# EAGLE design fio_v1.1 (EAGLE 5.02)
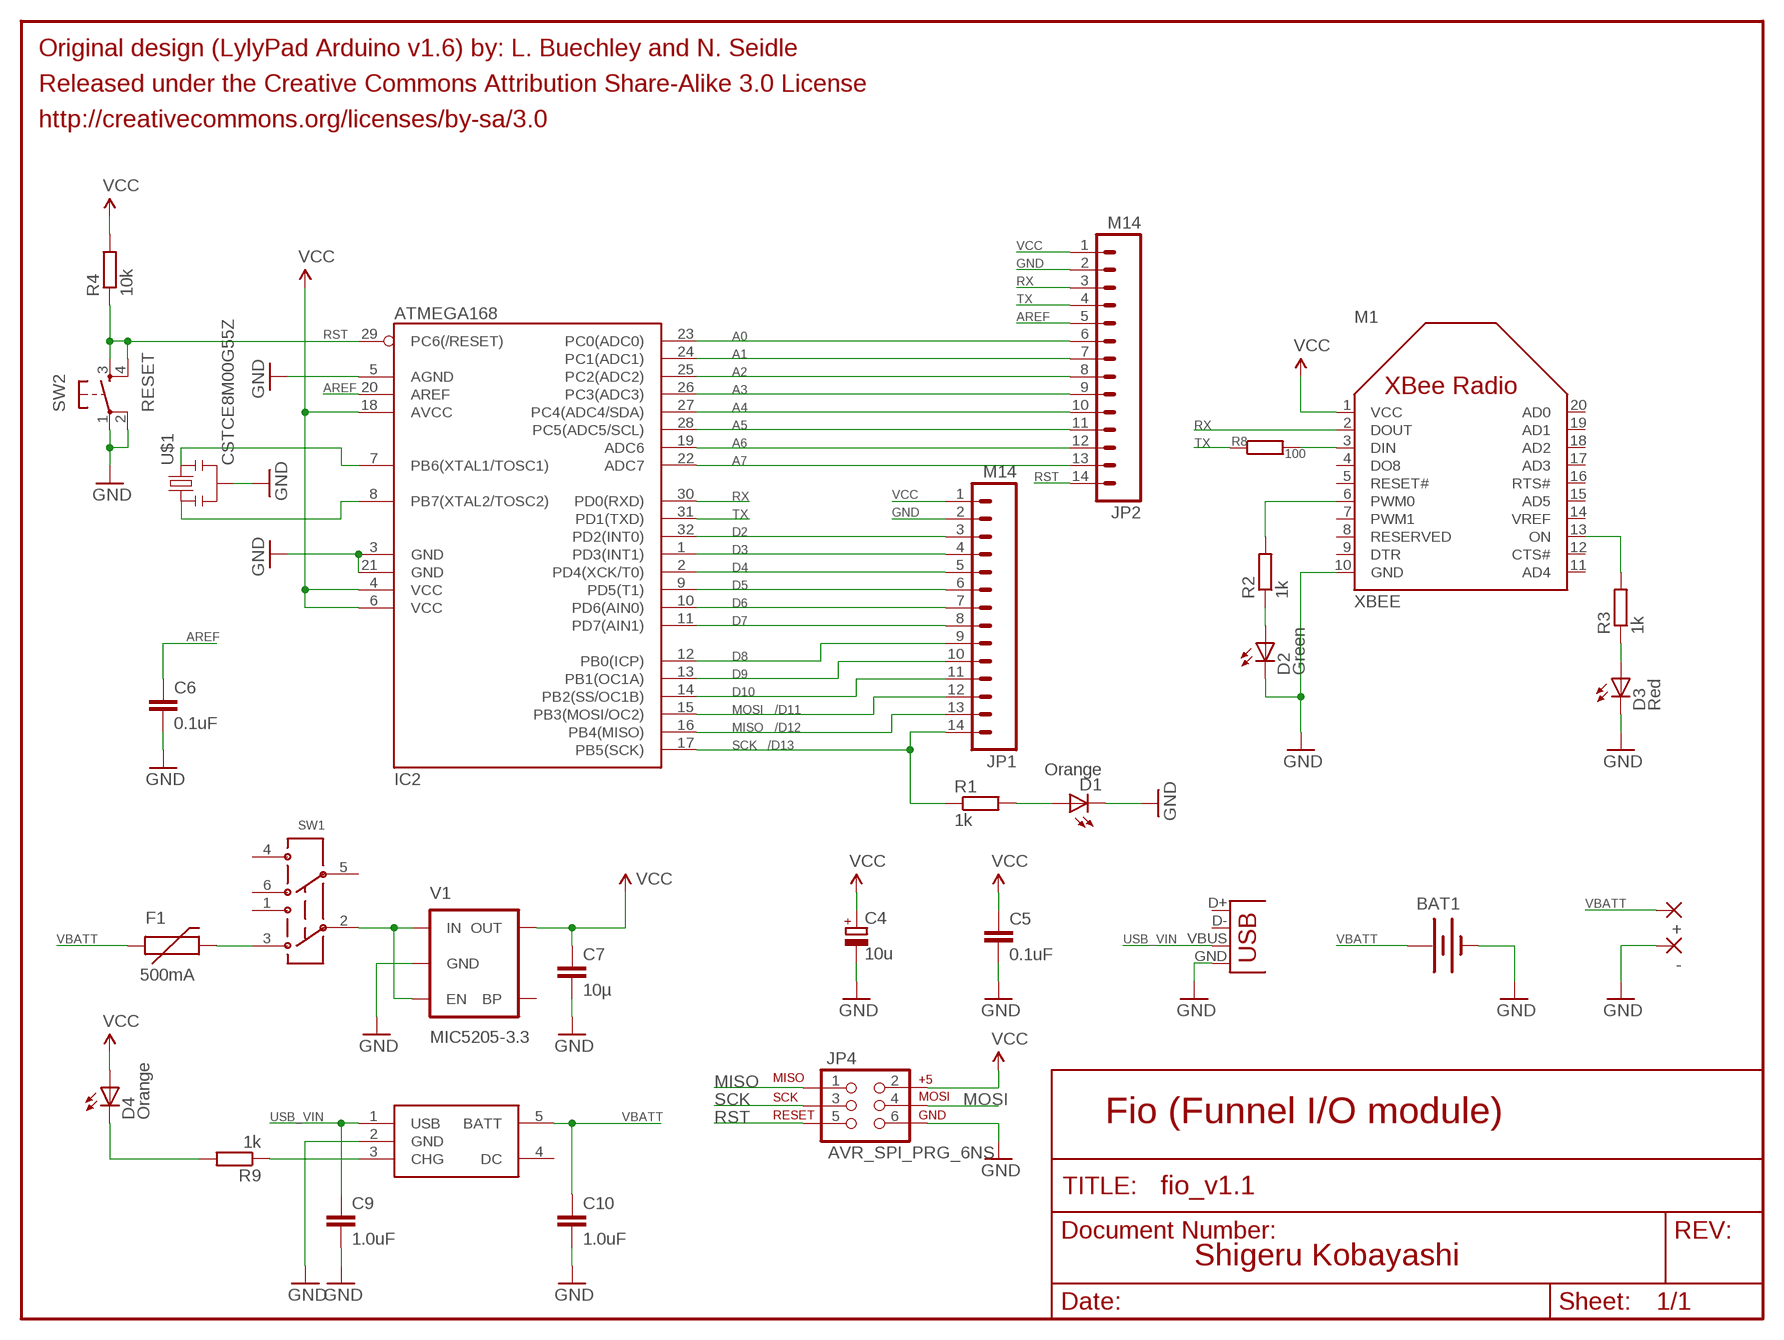
[diagram p0: schematic, sheet 1]

## Parts
+  SMD5  [SMD2,54-5,08]
-  SMD5  [SMD2,54-5,08]
BAT1  BATTERY2032  [BA2032SM]
C4  10u  CPOL-EUC  [PANASONIC_C]
C5  0.1uF  CAP0603  [0603]
C6  0.1uF  CAP0603  [0603]
C7  10µ  C-EUC0805K  [C0805K]
C9  1.0uF  CAP0603  [0603]
C10  1.0uF  CAP0603  [0603]
D1  Orange  LEDCHIPLED_0805  [CHIPLED_0805]
D2  Green  LEDCHIPLED_0805  [CHIPLED_0805]
D3  Red  LEDCHIPLED_0805  [CHIPLED_0805]
D4  Orange  LEDCHIPLED_0805  [CHIPLED_0805]
F1  500mA  PTCSMD  [PTC-1206]
IC2  ATMEGA168  [TQFP32-08]
JP1  M14  [1X14]
JP2  M14  [1X14]
JP4  AVR_SPI_PRG_6NS  [2X3-NS]
M1  XBEE  [XBEE]
R1  1k  R-EU_R0603  [R0603]
R2  1k  R-EU_R0603  [R0603]
R3  1k  R-EU_R0603  [R0603]
R4  10k  R-EU_R0603  [R0603]
R8  100  R-EU_R0603  [R0603]
R9  1k  R-EU_R0603  [R0603]
SW1  AYZ0202  [AYZ0202]
SW2  RESET  OMRON_B3SN-3012  [B3SN-3012]
U1  MAX1555  [SOT23-5]
U$1  CSTCE8M00G55Z  RESONATORSMD  [RESONATOR-SMD]
V1  MIC5205-3.3  V_REG_LDOSMD  [SOT23-5]
X1  USBSMD  [USB-MINIB]

## Nets
A0: IC2.23(PC0(ADC0)) JP2.6
A1: IC2.24(PC1(ADC1)) JP2.7
A2: IC2.25(PC2(ADC2)) JP2.8
A3: IC2.26(PC3(ADC3)) JP2.9
A4: IC2.27(PC4(ADC4/SDA)) JP2.10
A5: IC2.28(PC5(ADC5/SCL)) JP2.11
A6: IC2.19(ADC6) JP2.12
A7: IC2.22(ADC7) JP2.13
AREF: C6.1 IC2.20(AREF) JP2.5
D2: IC2.32(PD2(INT0)) JP1.3
D3: IC2.1(PD3(INT1)) JP1.4
D4: IC2.2(PD4(XCK/T0)) JP1.5
D5: IC2.9(PD5(T1)) JP1.6
D6: IC2.10(PD6(AIN0)) JP1.7
D7: IC2.11(PD7(AIN1)) JP1.8
D8: IC2.12(PB0(ICP)) JP1.9
D9: IC2.13(PB1(OC1A)) JP1.10
D10: IC2.14(PB2(SS/OC1B)) JP1.11
GND: -.1(P) BAT1.- C4.- C5.2 C6.2 C7.2 C9.2 C10.2 D1.C D2.C D3.C IC2.3(GND) IC2.5(AGND) IC2.21(GND) JP1.2 JP2.2 JP4.6 M1.10(GND) SW2.1 SW2.2 U1.2(GND) U$1.2 V1.2(GND) X1.GND
MISO: IC2.16(PB4(MISO)) JP1.13 JP4.1
MOSI: IC2.15(PB3(MOSI/OC2)) JP1.12 JP4.4
N$1: M1.13(ON) R3.2
N$2: D1.A R1.2
N$3: D2.A R2.1
N$4: M1.6(PWM0) R2.2
N$5: SW1.2 V1.1(IN) V1.3(EN)
N$6: D3.A R3.1
N$7: M1.3(DIN) R8.2
N$8: D4.C R9.2
N$9: F1.2 SW1.3
N$10: IC2.7(PB6(XTAL1/TOSC1)) U$1.3
N$11: R9.1 U1.3(CHG)
N$12: IC2.8(PB7(XTAL2/TOSC2)) U$1.1
RST: IC2.29(PC6(/RESET)) JP2.14 JP4.5 R4.1 SW2.3 SW2.4
RX: IC2.30(PD0(RXD)) JP2.3 M1.2(DOUT)
SCK: IC2.17(PB5(SCK)) JP1.14 JP4.3 R1.1
TX: IC2.31(PD1(TXD)) JP2.4 R8.1
USB_VIN: C9.1 U1.1(USB) X1.VBUS
VBATT: +.1(P) BAT1.+ C10.1 F1.1 U1.5(BATT)
VCC [VCC]: C4.+ C5.1 C7.1 D4.A IC2.4(VCC) IC2.6(VCC) IC2.18(AVCC) JP1.1 JP2.1 JP4.2 M1.1(VCC) R4.2 V1.5(OUT)
Unconnected: M1.4(DO8) M1.5(RESET#) M1.7(PWM1) M1.8(RESERVED) M1.9(DTR) M1.11(AD4) M1.12(CTS#) M1.14(VREF) M1.15(AD5) M1.16(RTS#) M1.17(AD3) M1.18(AD2) M1.19(AD1) M1.20(AD0) SW1.1 SW1.4 SW1.5 SW1.6 U1.4(DC) V1.4(BP) X1.D+ X1.D-

## Notes on the sheet
- Original design (LylyPad Arduino v1.6) by: L. Buechley and N. Seidle
- Released under the Creative Commons Attribution Share-Alike 3.0 License
- http://creativecommons.org/licenses/by-sa/3.0
- /D11
- /D12
- /D13
- Fio (Funnel I/O module)
- Shigeru Kobayashi

## Library data of the parts
+ - = wirepad:SMD5: SMD PAD
BAT1 = memory_protection_devices:BATTERY: Battery Holders 2032 coin cell and 2450 coin cell.
C4 = rcl:CPOL-EU: POLARIZED CAPACITOR, European symbol
C5 C6 C9 C10 = SparkFun:CAP: Capacitor Standard 0603 ceramic capacitor, and 0.1" leaded capacitor.
C7 = rcl:C-EU: CAPACITOR, European symbol
D1-D4 = led:LED: LED OSRAM: - CHIPLED LG R971, LG N971, LY N971, LG Q971, LY Q971, LO R971, LY R971 LH N974, LH R974 LS Q976, LO Q976, LY Q976 LO Q996 - Hyper CHIPLED LW Q18S LB Q993, LB Q99A, LB R99A - SideLED LS A670, LO A670, LY A670, LG A670, LP A670 LB A673, LV A673, LT A673, LW A673 LH A674 LY A675 LS A676, LA A676, LO A676, LY A676, LW A676 LS A679, LY A679, LG A679 - Hyper Micro SIDELED® LS Y876, LA Y876, LO Y876, LY Y876 LT Y87S - SmartLED LW L88C, LW L88S LB L89C, LB L89S, LG L890 LS L89K, LO L89K, LY L89K LS L896, LA L896, LO L896, LY L896 - TOPLED LS T670, LO T670, LY T670, LG T670, LP T670 LSG T670, LSP T670, LSY T670, LOP T670, LYG T670 LG T671, LOG T671, LSG T671 LB T673, LV T673, LT T673, LW T673 LH T674 LS T676, LA T676, LO T676, LY T676, LB T676, LH T676, LSB T676, LW T676 LB T67C, LV T67C, LT T67C, LS T67K, LO T67K, LY T67K, LW E67C LS E67B, LA E67B, LO E67B, LY E67B, LB E67C, LV E67C, LT E67C LW T67C LS T679, LY T679, LG T679 LS T770, LO T770, LY T770, LG T770, LP T770 LB T773, LV T773, LT T773, LW T773 LH T774 LS E675, LA E675, LY E675, LS T675 LS T776, LA T776, LO T776, LY T776, LB T776 LHGB T686 LT T68C, LB T68C - Hyper Mini TOPLED® LB M676 - Mini TOPLED Santana® LG M470 LS M47K, LO M47K, LY M47K Source: http://www.osram.convergy.de - LUMILED® LXK2-PW12-R00, LXK2-PW12-S00, LXK2-PW14-U00, LXK2-PW14-V00 LXK2-PM12-R00, LXK2-PM12-S00, LXK2-PM14-U00 LXK2-PE12-Q00, LXK2-PE12-R00, LXK2-PE12-S00, LXK2-PE14-T00, LXK2-PE14-U00 LXK2-PB12-K00, LXK2-PB12-L00, LXK2-PB12-M00, LXK2-PB14-N00, LXK2-PB14-P00, LXK2-PB14-Q00 LXK2-PR12-L00, LXK2-PR12-M00, LXK2-PR14-Q00, LXK2-PR14-R00 LXK2-PD12-Q00, LXK2-PD12-R00, LXK2-PD12-S00 LXK2-PH12-R00, LXK2-PH12-S00 LXK2-PL12-P00, LXK2-PL12-Q00, LXK2-PL12-R00 Source: www.luxeon.com
F1 = SparkFun:PTC: Resettable Fuse PTC Resettable Fuse. Spark Fun Electronics SKU : COM-08357
IC2 = SparkFun:ATMEGA168
JP1 JP2 = SparkFun:M14: Header 14 Standard 14-pin 0.1" header. Use with straight break away headers (SKU : PRT-00116), right angle break away headers (PRT-00553), swiss pins (PRT-00743), machine pins (PRT-00117), and female headers (PRT-00115).
JP4 = SparkFun:AVR_SPI_PRG_6: AVR ISP 6 Pin This is the reduced ISP connector for AVR programming. Common on Arduino. This footprint will take up less PCB space and can be used with a 10-pin to 6-pin adapter such as SKU: BOB-08508
M1 = digi_xbee:XBEE
R1-R4 R8 R9 = rcl:R-EU_: RESISTOR, European symbol
SW1 = SparkFun:AYZ0202: SPDT Slide Switch Simple SMD single-pull double-throw slide switch. Good for less than 350mA power switch, switching UARTs between devices, etc. Spark Fun Electronics SKU : COM-00597
SW2 = omron_b3sn:OMRON_: Momentary Switch Button commonly used for reset or general input. Spark Fun Electronics SKU : COM-00097
U1 = SparkFun:MAX1555: MAX1555 Lithium Charger IC SOT-23 Lithium Polymer charging IC. Schematic element and footprint proven. Spark Fun Electronics SKU : COM-00674
U$1 = SparkFun:RESONATOR: Resonator Small SMD resonator. This is the itty bitty 10/20MHz resonators with built in caps. CSTCE10M0G55 and CSTCE20M0V53. Footprint has been reviewed closely but hasn't been tested yet.
V1 = SparkFun:V_REG_LDO: Voltage Regulator LDO Standard 150mA LDO voltage regulator in SOT-23 layout. Micrel part MIC5205. BP (by-pass) pin is used to lower output noise with 470pF cap.
X1 = SparkFun:USB: USB Connectors USB-B-PTH is fully proven SKU : PRT-00139 USB-miniB is fully proven SKU : PRT-00587 USB-A-PCB is untested. USB-A-H is throughly reviewed, but untested. Spark Fun Electronics SKU : PRT-00437 USB-B-SMT is throughly reviewed, but untested. Needs silkscreen touching up. USB-A-S has not been used/tested USB-MB-H has not been used/tested

## Net classes
0 Default: width 0.203 mm
1 VCC: width 0.381 mm
2 LEDPower: width 0.203 mm
3 ButtonSignal: width 0.203 mm

## Board
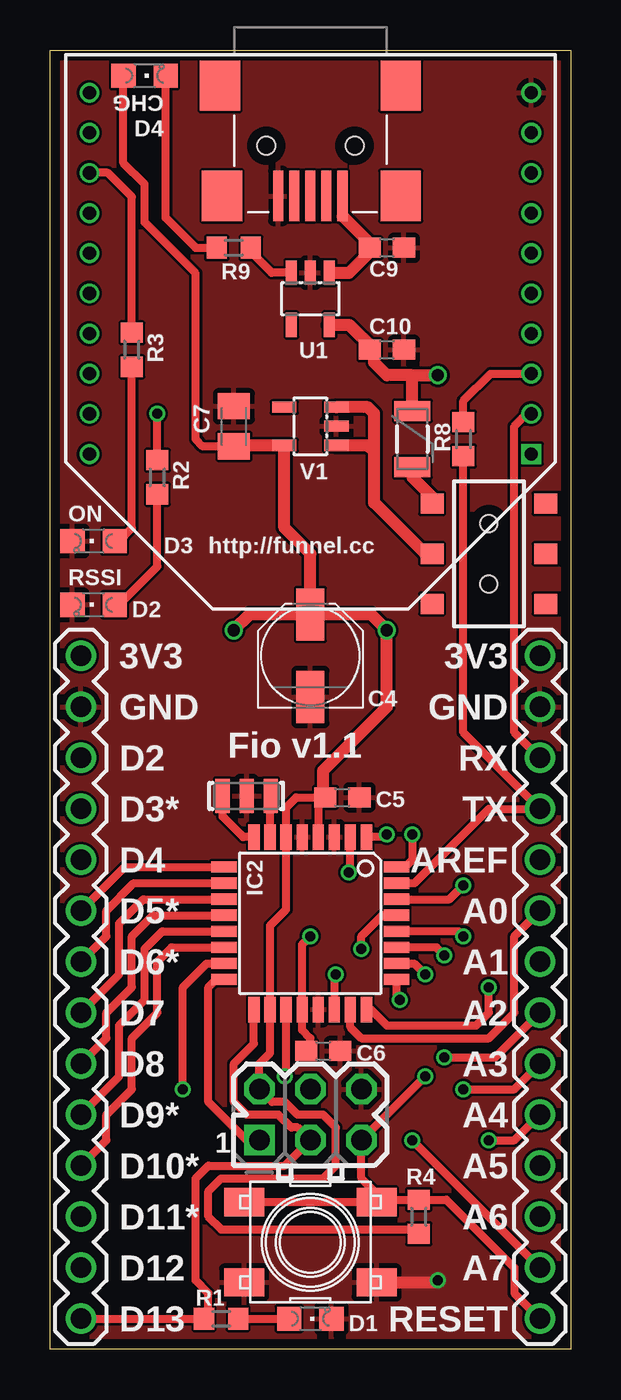
[diagram p1: board, top side]
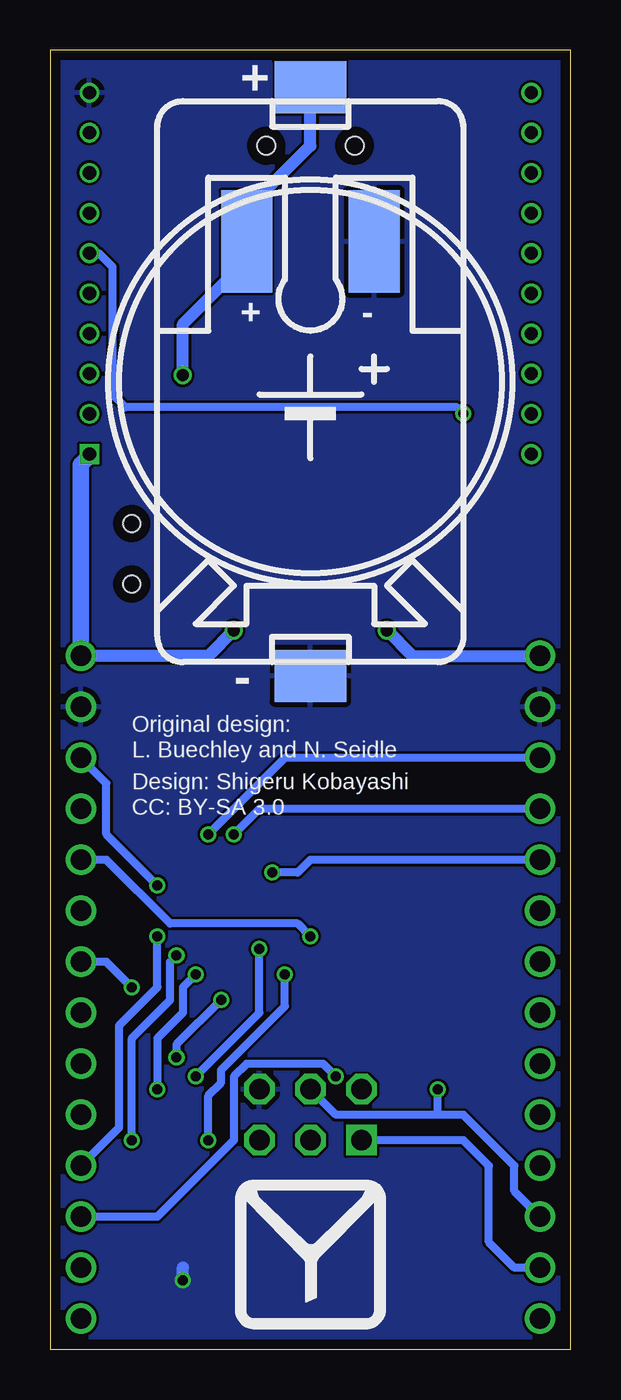
[diagram p2: board, bottom side, seen from below]

Size 25.91 x 64.71 mm. Coordinates in mm from the lower left corner, seen from the top.
Outline: 25.91,64.71 25.91,0 0,0 0,64.71 25.91,64.71
Copper layers (1*16): Top 0.035mm / dielectric 1.5mm / Bottom 0.035mm
Design rules "p_ban_2layer *": minimum track width 5mil, minimum drill 0.3mm, track to track 5mil, track to pad 5mil, pad to pad 5mil, via to via 5mil, smd to smd 5mil, copper to edge 0.5mm, drill to drill 0.3mm, minimum pad ring 0.15mm, minimum via ring 0.15mm, stop-mask expansion 4mil, vias tented up to drill 0.35mm, thermal gap 10mil

### Footprints (pad centres in the part's own frame; a part is rotated, then mirrored left to right if it is on the bottom)
SMD2,54-5,08 = smd 2.54 x 5.08: 1 0,0
BA2032SM = smd 2.591 x 3.556: + 14.656,0; - -14.656,0
PANASONIC_C = smd 2.6 x 1.4: + 2.05,0; - -2.05,0
0603@1 = smd 1.1 x 1: 1 -0.85,0; 2 0.85,0
C0805K = smd 1.3 x 1.6: 1 -1,0; 2 1,0
CHIPLED_0805 = smd 1.2 x 1.2: A 0,-1.05; C 0,1.05
PTC-1206 = smd 1 x 1.8: 1 -1.4,0; 2 1.4,0
TQFP32-08 = smd 1.27 x 0.559: 1 -4.293,2.8; 2 -4.293,2; 3 -4.293,1.2; 4 -4.293,0.4; 5 -4.293,-0.4; 6 -4.293,-1.2; 7 -4.293,-2; 8 -4.293,-2.8; 17 4.293,-2.8; 18 4.293,-2; 19 4.293,-1.2; 20 4.293,-0.4; 21 4.293,0.4; 22 4.293,1.2; 23 4.293,2; 24 4.293,2.8 | smd 0.559 x 1.27: 9 -2.8,-4.293; 10 -2,-4.293; 11 -1.2,-4.293; 12 -0.4,-4.293; 13 0.4,-4.293; 14 1.2,-4.293; 15 2,-4.293; 16 2.8,-4.293; 25 2.8,4.293; 26 2,4.293; 27 1.2,4.293; 28 0.4,4.293; 29 -0.4,4.293; 30 -1.2,4.293; 31 -2,4.293; 32 -2.8,4.293
1X14 = drill 1.016 round: 1 0,0; 2 2.54,0; 3 5.08,0; 4 7.62,0; 5 10.16,0; 6 12.7,0; 7 15.24,0; 8 17.78,0; 9 20.32,0; 10 22.86,0; 11 25.4,0; 12 27.94,0; 13 30.48,0; 14 33.02,0
2X3-NS = drill 1.016 square: 1 -2.54,-1.27 | drill 1.016 octagon: 2 -2.54,1.27; 3 0,-1.27; 4 0,1.27; 5 2.54,-1.27; 6 2.54,1.27
XBEE = drill 0.66 square: 1 -11,9 | drill 0.66 round: 2 -11,7; 3 -11,5; 4 -11,3; 5 -11,1; 6 -11,-1; 7 -11,-3; 8 -11,-5; 9 -11,-7; 10 -11,-9; 11 11,-9; 12 11,-7; 13 11,-5; 14 11,-3; 15 11,-1; 16 11,1; 17 11,3; 18 11,5; 19 11,7; 20 11,9
R0603 = smd 1 x 1.1: 1 -0.85,0; 2 0.85,0
AYZ0202 = smd 1 x 1.15: 1 -2.5,2.825; 2 0,2.825; 3 2.5,2.825; 4 -2.5,-2.825; 5 0,-2.825; 6 2.5,-2.825 | hole 0.85: 1.5,0; -1.5,0
B3SN-3012 = smd 2 x 1.4: 1 3.3,-2; 2 -3.3,-2; 3 3.3,2; 4 -3.3,2
SOT23-5 = smd 0.55 x 1.2: 1 -0.95,-1.3; 2 0,-1.3; 3 0.95,-1.3; 4 0.95,1.3; 5 -0.95,1.3
RESONATOR-SMD = smd 0.7 x 1.7: 1 -1.2,0; 2 0,0; 3 1.2,0
USB-MINIB = smd 2.5 x 0.5: D+ 2.5,0; D- 2.5,0.8; GND 2.5,-1.6; ID 2.5,-0.8; VBUS 2.5,1.6 | smd 2.5 x 2: P$1 -3,-4.5; P$2 -3,4.5; P$3 2.5,-4.4; P$4 2.5,4.5 | hole 0.9: 0,2.2; 0,-2.2

### Placement (x,y rotation side)
+  16.13,55.18 0 bottom
-  9.78,55.18 0 bottom
BAT1  12.95,48.2 90 bottom
C4  12.95,34.54 90 top
C5  0.1uF  [0603@1]  14.55,27.49 0 top
C6  0.1uF  [0603@1]  13.59,14.86 0 top
C7  9.14,45.97 90 top
C9  1.0uF  [0603@1]  16.76,54.86 0 top
C10  1.0uF  [0603@1]  16.76,49.78 0 top
D1  12.95,1.52 270 top
D2  2.16,37.08 90 top
D3  2.16,40.26 90 top
D4  4.7,63.44 270 top
F1  18.03,45.34 270 top
IC2  ATMEGA168V  [TQFP32-08]  12.94,21.22 270 top
JP1  1.52,34.54 270 top
JP2  24.38,34.54 270 top
JP4  SPI_PROG  [2X3-NS]  12.95,11.68 0 top
M1  12.95,53.59 180 top
R1  8.51,1.52 0 top
R2  5.33,43.43 90 top
R3  4.06,49.78 90 top
R4  18.35,6.6 270 top
R8  20.57,45.34 90 top
R9  9.14,54.86 180 top
SW1  21.84,39.62 90 top
SW2  12.95,5.33 0 top
U1  12.95,52.32 180 top
U$1  9.78,27.56 0 top
U$2  [FUNNEL_LOGO_BOTTOM]  12.95,4.7 0 top
V1  12.95,45.97 90 top
X1  12.95,59.94 270 top

### Tracks (layer width: path | path; a pad name or v marks a point on that pad's centre or on a via)
A0
  Top 0.406: IC2.23 14.94,16.04 15.49,15.49 21.84,15.49 23.11,16.76 23.11,20.57 JP2.6
A1  (via drill 0.5)
  Top 0.406: IC2.24 15.97,16.93 16.76,16.13 21.21,16.13 21.84,16.76 v21.84,18.03
  Bottom 0.406: JP2.7 23.11,19.3 v21.84,18.03
A2  (via drill 0.5)
  Top 0.406: IC2.25 17.24,17.56 v17.4,17.4 | v19.62,14.54 22.16,14.54 JP2.8
  Bottom 0.406: v17.4,17.4 19.62,15.18 v19.62,14.54
A3  (via drill 0.5)
  Top 0.406: IC2.26 18.12,19.22 v18.67,18.67 | v20.57,12.95 23.11,12.95 JP2.9
  Bottom 0.406: v18.67,18.67 19.3,18.03 19.3,16.76 20.57,15.49 v20.57,12.95
A4  (via drill 0.5)
  Top 0.406: JP2.10 23.11,10.41 v21.84,10.41 | IC2.27 19.22,20.02 v19.62,19.62
  Bottom 0.406: v21.84,10.41 21.84,15.49 19.94,17.4 19.94,19.3 v19.62,19.62
A5  (via drill 0.5)
  Top 0.406: IC2.28 20.33,20.82 v20.57,20.57
  Bottom 0.406: JP2.11 22.48,11.05 22.48,16.13 20.57,18.03 v20.57,20.57
A6  (via drill 0.5)
  Top 0.406: IC2.19 11.74,13.65 v11.68,13.59
  Bottom 0.406: JP2.12 20.57,6.6 16.76,10.41 16.76,13.59 16.13,14.22 12.32,14.22 v11.68,13.59
A7  (via drill 0.5)
  Top 0.406: IC2.22 14.14,18.59 v14.22,18.67 | JP2.13 v18.03,10.41
  Bottom 0.406: v14.22,18.67 14.22,17.08 17.4,13.91 17.4,13.27 18.03,12.64 v18.03,10.41
AREF  (via drill 0.5)
  Top 0.406: C6.1 12.95,14.86 12.95,15.49 12.54,15.9 IC2.20 12.54,20.16 v12.95,20.57
  Bottom 0.406: v12.95,20.57 13.59,21.21 19.94,21.21 23.11,24.38 JP2.5
D2  (via drill 0.5)
  Top 0.406: IC2.32 17.67,24.02 18.03,24.38 v18.03,25.65
  Bottom 0.406: JP1.3 12.95,29.46 | 12.95,29.46 13.59,29.46 | v18.03,25.65 14.22,29.46 12.95,29.46
D3  (via drill 0.5)
  Top 0.406: IC2.1 16.62,25.51 v16.76,25.65
  Bottom 0.406: v16.76,25.65 15.49,26.92 JP1.4
D4  (via drill 0.5)
  Top 0.406: IC2.2 14.94,23.83 v14.86,23.75
  Bottom 0.406: JP1.5 12.95,24.38 13.59,23.75 v14.86,23.75
D5
  Top 0.406: IC2.9 3.7,24.02 JP1.6
D6
  Top 0.406: IC2.10 4.17,23.22 2.79,21.84 2.79,20.57 JP1.7
D7
  Top 0.406: IC2.11 4.64,22.42 3.43,21.21 3.43,18.67 JP1.8
D8
  Top 0.406: IC2.12 5.11,21.62 4.06,20.57 4.06,18.03 2.79,16.76 2.79,15.49 JP1.9
D9
  Top 0.406: IC2.13 5.58,20.82 4.7,19.94 4.7,17.4 3.43,16.13 3.43,13.59 JP1.10
D10
  Top 0.406: IC2.14 6.05,20.02 5.33,19.3 5.33,16.76 4.06,15.49 4.06,12.95 2.79,11.68 2.79,10.41 JP1.11
GND  (via drill 0.5)
  Top 0.61: SW2.1 19.3,3.33 v19.3,3.43
  Bottom 0.61: v19.3,3.43 19.3,4.06
  pour Top: -1.02,65.02 26.92,65.02 26.92,-1.02 -1.02,-1.02
  pour Bottom: -2.29,66.29 28.19,66.29 28.19,-2.29 -2.29,-2.29
MISO
  Top 0.406: IC2.16 8.26,18.42 7.87,18.03 7.87,12.32 9.78,10.41 JP4.1
  Bottom 0.406: JP1.13 2.79,4.06 4.06,5.33 4.06,9.14 5.33,10.41 JP4.1
MOSI  (via drill 0.5)
  Top 0.406: IC2.15 7.79,19.22 6.6,18.03 v6.6,12.95
  Bottom 0.406: JP1.12 2.79,7.87 2.79,9.14 5.33,11.68 6.6,11.68 | 6.6,11.68 11.68,11.68 JP4.4 | 6.6,11.68 v6.6,12.95
N$1
  Top 0.406: M1.13 2.87,58.59 4.06,57.4 R3.2
N$2
  Top 0.406: R1.2 D1.A
N$3
  Top 0.406: D2.A 3.43,37.08 5.33,38.99 R2.1
N$4  (via drill 0.5)
  Top 0.406: R2.2 v5.33,46.61
  Bottom 0.406: M1.6 23.48,54.59 22.8,53.91 22.8,47.56 22.16,46.93 5.65,46.93 v5.33,46.61
N$5
  Top 0.406: SW1.2 18.67,39.62
  Top 0.61: V1.1 15.81,45.02 16.13,44.7 | 18.67,39.62 16.13,42.16 16.13,44.7 | V1.3 15.81,46.92 16.13,46.61 16.13,44.7
N$6
  Top 0.406: D3.A 3.43,40.26 4.06,40.89 R3.1
N$7
  Top 0.406: R8.2 20.57,47.24 21.92,48.59 M1.3
N$8
  Top 0.406: R9.2 7.24,54.86 5.75,56.35 D4.C
N$9
  Top 0.406: SW1.3 19.02,42.45
  Top 0.61: F1.2 18.03,43.43 19.02,42.45
N$10
  Top 0.406: U$1.3 11.05,27.56 10.94,27.45 IC2.7
N$11
  Top 0.406: R9.1 9.78,54.86 11.02,53.62 U1.3
N$12
  Top 0.406: U$1.1 8.58,26.54 9.6,25.51 IC2.8
RST  (via drill 0.5)
  Top 0.406: IC2.29 16.54,21.62 15.49,20.57 v15.49,19.94 | v18.67,13.59 JP4.5 15.49,8.51 16.13,7.87 16.13,7.24 | SW2.4 16.03,7.33 16.13,7.24 | 16.13,7.24 16.22,7.33 SW2.3 | 16.13,7.24 16.34,7.45 R4.1 19.72,7.45 23.11,4.06 23.11,2.79 JP2.14
  Bottom 0.406: v15.49,19.94 15.49,16.76 v18.67,13.59
RX  (via drill 0.5)
  Top 0.406: IC2.30 19.88,22.42 v20.57,23.11 | JP2.3 23.11,30.73 23.11,45.97 23.73,46.59 M1.2
  Bottom 0.406: v20.57,23.11 23.11,25.65 23.11,28.19 JP2.3
SCK
  Top 0.406: IC2.17 10.14,15.22 9.14,14.22 9.14,12.32 9.78,11.68 11.37,11.68 12,11.05 12.32,11.05 JP4.3 11.68,9.14 7.87,9.14 7.24,8.51 7.24,3.43 7.87,2.79 7.87,1.52 R1.1 | R1.1 7.66,1.74 | JP1.14 R1.1
TX
  Top 0.406: IC2.31 18.14,23.22 21.84,26.92 JP2.4 20.57,30.73 R8.1
USB_VIN
  Top 0.406: 14.55,56.44 X1.VBUS | 16.13,54.86 C9.1
  Top 0.61: U1.1 14.89,53.62 16.13,54.86 14.55,56.44
VBATT  (via drill 0.6)
  Top 0.406: 16.13,49.78 C10.1
  Top 0.61: U1.5 14.89,51.02 16.13,49.78 16.13,49.15 16.76,48.51 18.03,48.51 | 18.03,48.51 v19.3,48.51 | F1.1 18.03,48.51
  Bottom 0.61: BAT1.+ 12.95,59.94 15.49,57.4 15.49,54.86 16.76,54.86 16.76,53.59 | v19.3,48.51 19.3,51.05 16.76,53.59 | +.1 16.13,54.23 16.76,53.59
VCC  (via drill 0.6)
  Top 0.406: IC2.4 13.34,27.31 13.59,27.56 13.66,27.49 C5.1 12.25,27.49 11.74,26.98 IC2.6 11.74,21.9 10.94,21.1 IC2.18 10.94,14.75 10.41,14.22 JP4.2 11.05,12.32 11.68,12.32 12.32,11.68 13.59,11.68 14.22,11.05 14.22,9.14 13.59,8.51 8.51,8.51 7.87,7.87 7.87,6.6 8.51,5.97 18.35,5.97 R4.2 | 9.46,45.02 9.14,45.34 C7.1 7.6,44.97 7.24,45.34 7.24,53.59 4.7,56.13 4.7,58.04 3.65,59.09 D4.A
  Top 0.61: 9.46,45.02 V1.5 11.65,40.92 12.95,39.62 C4.+ | C4.+ 15.98,36.59 v16.76,35.81 16.76,32 13.59,28.83 13.59,27.56 | C4.+ 9.92,36.59 v9.14,35.81
  Bottom 0.406: 23.75,44.7 23.86,44.59 M1.1
  Bottom 0.61: v16.76,35.81 18.03,34.54 JP2.1 | v9.14,35.81 7.87,34.54 JP1.1
  Bottom 0.813: JP2.1 24.38,44.07 23.86,44.59

### Text on the board
tPlace: CHG | ON | http://funnel.cc | RSSI | 3V3 | 3V3 | GND | GND | RX | D2 | Fio v1.1 | TX | D3* | AREF | D4 | A0 | D5* | A1 | D6* | A2 | D7 | A3 | D8 | A4 | D9* | 1 | A5 | D10* | A6 | D11* | A7 | D12 | RESET | D13
bPlace: + | - | Original design: | L. Buechley and N. Seidle | Design: Shigeru Kobayashi | CC: BY-SA 3.0